# EAGLE design working (EAGLE 6.4)
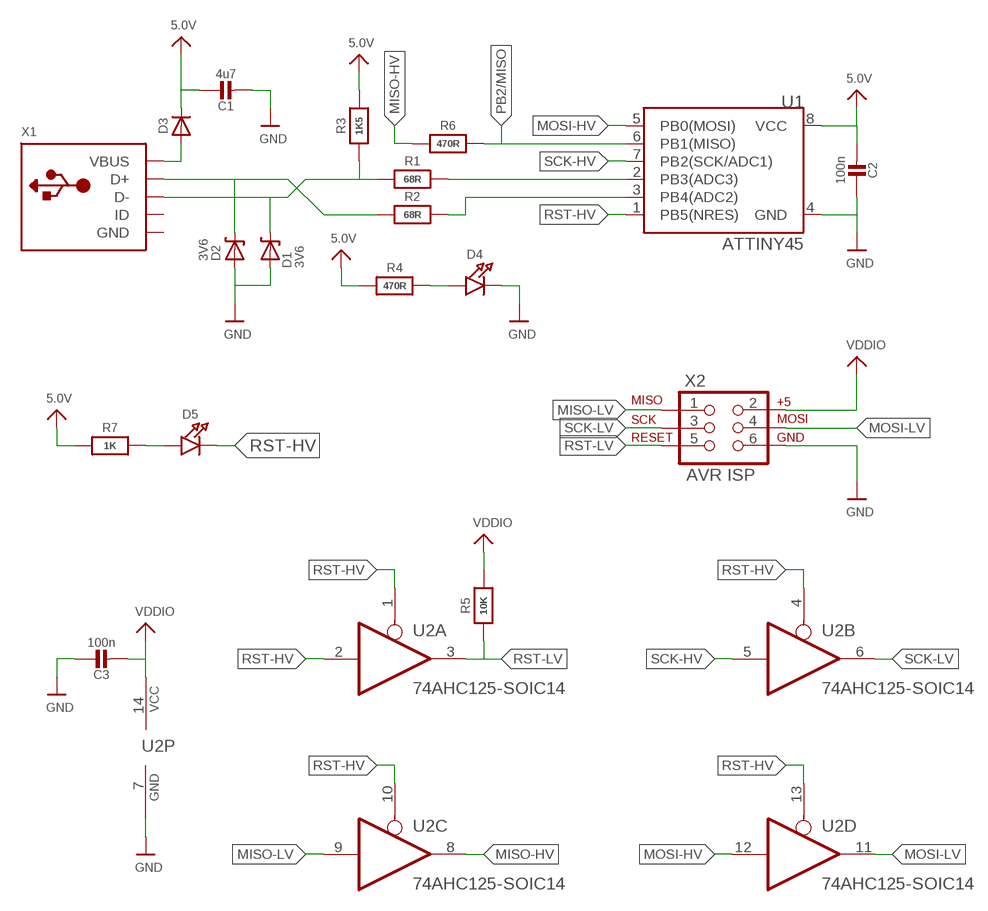
[diagram p0: schematic, sheet 1]

## Parts
C1  4u7  CAP_CERAMIC0805-NOOUTLINE  [0805-NO]
C2  100n  CAP_CERAMIC0805-NOOUTLINE  [0805-NO]
C3  100n  CAP_CERAMIC0805-NOOUTLINE  [0805-NO]
D1  3V6  DIODE-ZENERSOD323  [SOD-323]
D2  3V6  DIODE-ZENERSOD323  [SOD-323]
D3  DIODESOD-123  [SOD-123]
D4  LED0805_NOOUTLINE  [CHIPLED_0805_NOOUTLINE]
D5  LED0805_NOOUTLINE  [CHIPLED_0805_NOOUTLINE]
R1  68R  RESISTOR_0603_NOOUT  [0603-NO]
R2  68R  RESISTOR_0603_NOOUT  [0603-NO]
R3  1K5  RESISTOR_0603_NOOUT  [0603-NO]
R4  470R  RESISTOR_0603_NOOUT  [0603-NO]
R5  10K  RESISTOR_0603_NOOUT  [0603-NO]
R6  470R  RESISTOR_0603_NOOUT  [0603-NO]
R7  1K  RESISTOR_0603_NOOUT  [0603-NO]
U1  ATTINY45  [SO08-EIAJ]
U2  74AHC125-SOIC14  74125-SOIC14  [SOIC14]
X1  USBMINIBLARGE  [USB-MINIB_LARGER]
X2  AVR ISP  AVR_SPI_PRG_6SMD  [2X3_SMD]

## Nets
5.0V: C1.1 C2.2 D3.C R3.2 R4.1 R7.1 U1.8(VCC)
GND: C1.2 C2.1 C3.1 D1.A D2.A D4.C U1.4(GND) U2.7(P:GND) X2.6
MISO-HV: R6.1 U2.8(C:O)
MISO-LV: U2.9(C:I) X2.1
MOSI-HV: U1.5(PB0(MOSI)) U2.12(D:I)
MOSI-LV: U2.11(D:O) X2.4
N$1: D1.C R1.1 R3.1 X1.D-
N$2: D2.C R2.1 X1.D+
N$3: D5.A R7.2
N$4: R1.2 U1.2(PB3(ADC3))
N$5: R2.2 U1.3(PB4(ADC2))
N$7: D3.A X1.VBUS
N$9: D4.A R4.2
PB2/MISO: R6.2 U1.6(PB1(MISO))
RST-HV: D5.C U1.1(PB5(NRES)) U2.1(A:OE) U2.2(A:I) U2.4(B:OE) U2.10(C:OE) U2.13(D:OE)
RST-LV: R5.1 U2.3(A:O) X2.5
SCK-HV: U1.7(PB2(SCK/ADC1)) U2.5(B:I)
SCK-LV: U2.6(B:O) X2.3
VDDIO: C3.2 R5.2 U2.14(P:VCC) X2.2
Unconnected: X1.ID

## Power pins joined to a net without a drawn wire
GND: X1.GND X1.GND1(GND) X1.GND2(GND) X1.GND3(GND) X1.GND4(GND)

## Library data of the parts
C1-C3 = microbuilder:CAP_CERAMIC: Ceramic Capacitors For new designs, use the packages preceded by an '_' character since they are more reliable: The following footprints should be used on most boards: _0402 - Standard footprint for regular board layouts _0603 - Standard footprint for regular board layouts _0805 - Standard footprint for regular board layouts _1206 - Standard footprint for regular board layouts For extremely tight-pitch boards where space is at a premium, the following 'micro-pitch' footprints can be used (smaller pads, no silkscreen outline, etc.): _0402MP - Micro-pitch footprint for very dense/compact boards _0603MP - Micro-pitch footprint for very dense/compact boards _0805MP - Micro-pitch footprint for very dense/compact boards _1206MP - Micro-pitch footprint for very dense/compact boards
D1 D2 = microbuilder:DIODE-ZENER: Zener Diode SMA: 30V 1W Zener Diode, 1.2Vf - Digikey: SMAZ30-FDICT-ND
D3 = microbuilder:DIODE: Diode SMA Model Volts Amps Type Vf Ir Digikey # Notes SSA34-E3 40V 3A Schottky 480mV @ 3A 200uA @ 40V SSA34-E3/61TGITR-ND CDBA120-G 20V 1A Schottky 500mV @ 1A 500uA @ 20V 641-1014-6-ND REEL MBRA210 10V 2A Schottky 350mV @ 2A 700uA @ 10V MBRA210LT3 SOD-123 Model Volts Amps Type Vf Ir Order # Notes BAT54T1G 30V 200mA Schottky 800mV @ 200mA 2uA @ 25V BAT54T1GOSTR-ND B0530W 30V 500mA Schottky 430mV @ 500mA 130uA @ 30V B0530W-FDICT-ND REEL MBR120 20V 1A Schottky 340mV @ 1A MBR120VLSFT1GOSCT-ND SOD-323 Model Volts Amps Type Vf Ir Order # Notes PMEG2005EJ 20V 500mA Schottky 355mV @ 500mA 568-4110-1-ND ZLLS410 10V 570mA Schottky 380mV @ 570mA ZLLS410CT-ND 1N4148WS 75V 150mA Silicon/Simple 1V 1N4148WSFSCT-ND REEL SOD-523 Model Volts Amps Type Vf Ir Order # Notes BAT54XV2 30V 200mA Schottky 0.8V @ 100mA BAT54XV2CT-ND TB751S 30V 30mA Schottky RB751S-40TE61CT-ND SOT23-R/W (R = Solder Paste/Reflow Ovens, W = Hand-Soldering) Model Volts Amps Type Vf Ir Order # Notes BAT54FILM 40V 300mA Schottky 497-7162-1-ND POWERDI-5 Model Volts Amps Type Vf Ir Order # Notes PDS560 60V 5A Schottky 670mV @ 5A 150uA @ 60V PDS560DICT-ND
D4 D5 = microbuilder:LED: LED 0603 - 0603 Surface Mount Package 2mA: Green LED - Low Power (3.9mcd, 2ma, 1.7Vf) - Digikey: 475-2709-2-ND Orange LED - Low Power (9.8mcd, 2ma, 1.8Vf) - Digikey: 475-1194-2-ND Red LED - Low Power (5mcd, 2ma, 1.8Vf) - Digikey: 475-1195-2-ND Yellow LED - Low Power (7mcd, 2ma, 1.8Vf) - Digikey: 475-1196-2-ND 5mA: Blue LED - Low Power (17mcd, 5ma, 2.9Vf) - Digikey: LNJ937W8CRACT-ND 0805 - 0805 Surface Mount Package 2mA: Red LED (8.8mcd, 2mA, 1.8Vf, Clear) - Low Power [Digikey: 475-2510-1-ND] Green LED (5mcd, 2mA, 1.8Vf, Clear) - Low Power [Digikey: 475-2730-1-ND] Yellow LED (11.3mcd, 2mA, 1.8Vf, Clear) - Low Power [Digikey: 475-2555-1-ND] 20mA: Red LED (104mcd, 20mA, Diffused) - LS R976 [Digikey: 475-1278-6-ND] Red LED (12mcd, 20mA, 2.0Vf, Clear) - APT2012EC [Digikey: 754-1128-1-ND] Green LED (15mcd, 20mA, 2.2Vf, Clear) - APT2012GC [Digikey: 754-1131-1-ND] Orange LED (160mcd, 20mA, 2.1Vf, Clear) - APT2012SECK [Digikey: 754-1130-1-ND] 1206 - 1206 Surface Mount Package Green LED (26mcd, 20mA, Diffused) - LG N971 [Digikey: 475-1407-6-ND] Red LED (15mcd, 20mA, Diffused) - LH N974 [Digikey: 475-1416-6-ND] Cree - Cree High-Power Surface Mount LEDs XPEBWT-L1-0000-00D50 - White 111lm 350mA 2.9Vf 6200K 110° XTEAWT-00-0000-00000LEE3 - White 114lm 350mA 2.85Vf 5000K 115° Everlight - Everlight 45-21 Series Surface Mount LEDs 45-21/QK2C-B2832AC2CB2/2T - Warm White 2000mcd 20mA 3.25Vf 3050K 120° 45-21/LK2C-B38452C4CB2/2T - Nuetral White 2000mcd 20mA 3.25Vf 4150K 120° 45-21/LK2C-B50634C6CB2/2T - Cold White 2200mcd 20mA 3.25Vf 5650K 120° PLCC2 Reverse Mount LS T77K-J1L2-1-0-2-R18-Z - Red 11.25mcd 2mA 1.8Vf 630nm 120° LO T77K-L1M2-24-Z - Orange 19.6mcd 2mA 1.8Vf 606nm 120° LY T77K-K2M1-26-Z - Yellow 15.7mcd 2mA 1.8Vf 587nm 120°
R1-R7 = microbuilder:RESISTOR: Resistors For new designs, use the packages preceded by an '_' character since they are more reliable: The following footprints should be used on most boards: _0402 - Standard footprint for regular board layouts _0603 - Standard footprint for regular board layouts _0805 - Standard footprint for regular board layouts _1206 - Standard footprint for regular board layouts For extremely tight-pitch boards where space is at a premium, the following 'micro-pitch' footprints can be used (smaller pads, no silkscreen outline, etc.): _0402MP - Micro-pitch footprint for very dense/compact boards _0603MP - Micro-pitch footprint for very dense/compact boards _0805MP - Micro-pitch footprint for very dense/compact boards _1206MP - Micro-pitch footprint for very dense/compact boards
U1 = LittleWireISP:ATTINY45: Atmel ATTiny45
U2 = LittleWireISP:74*125: Quad bus BUFFER, 3-state
X1 = microbuilder:USB: USB Connectors USBMINIB - Surface Mount Female Mini-B USB Connector 4UConnector: 06564
X2 = LittleWireISP:AVR_SPI_PRG_6: AVR ISP 6 Pin This is the reduced ISP connector for AVR programming. Common on Arduino. This footprint will take up less PCB space and can be used with a 10-pin to 6-pin adapter such as SKU: BOB-08508

## Board
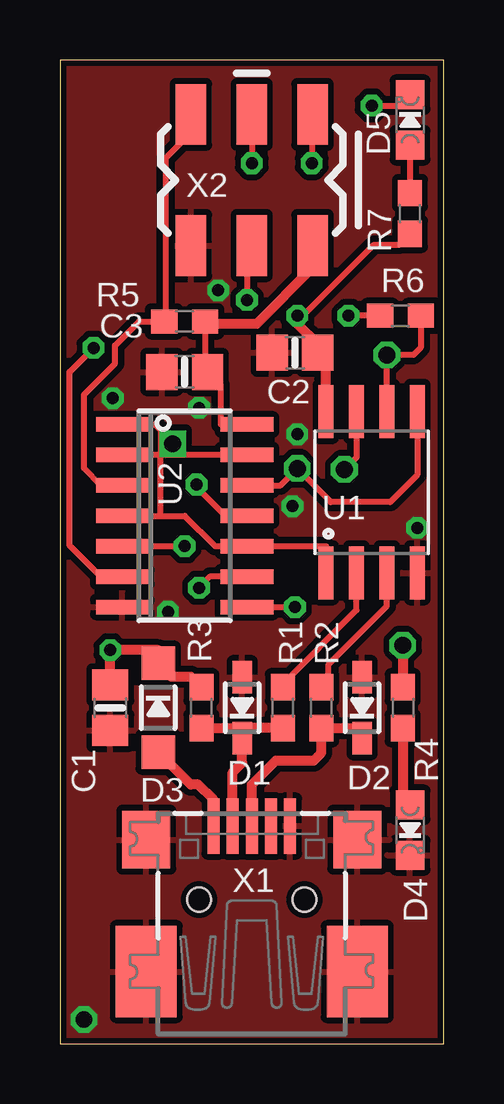
[diagram p1: board, top side]
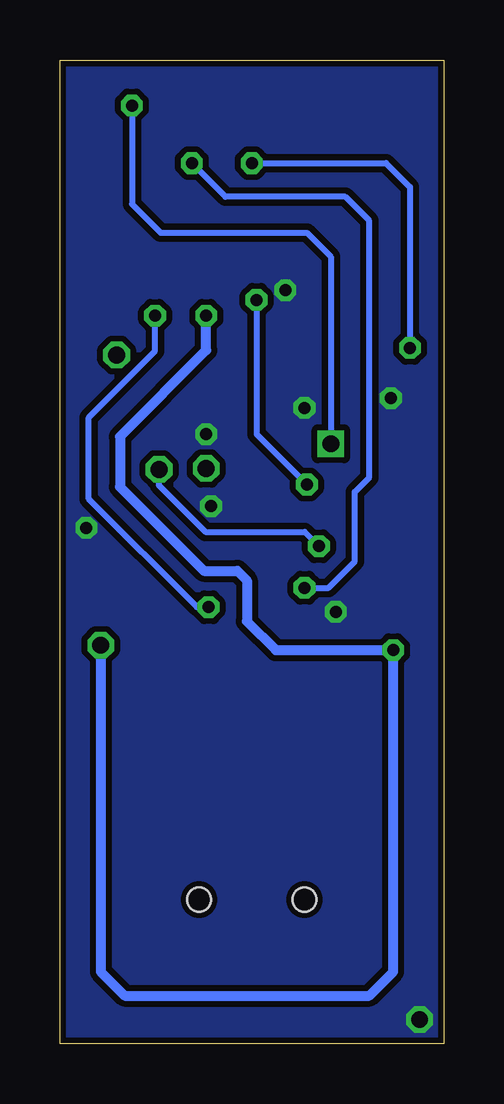
[diagram p2: board, bottom side, seen from below]

Size 16 x 41 mm. Coordinates in mm from the lower left corner, seen from the top.
Outline: 0,0 16,0 16,41 0,41 0,0
Copper layers (1*16): Top 0.035mm / dielectric 1.5mm / Bottom 0.035mm
Design rules "adafruit_rules_2": minimum track width 8mil, minimum drill 15.5mil, track to track 8mil, track to pad 8mil, pad to pad 8mil, via to via 8mil, smd to smd 8mil, copper to edge 10mil, drill to drill 8mil, minimum pad ring 10mil, minimum via ring 8mil, stop-mask expansion 4mil, vias tented up to drill 25mil, thermal gap 10mil

### Footprints (pad centres in the part's own frame; a part is rotated, then mirrored left to right if it is on the bottom)
0805-NO = smd 1.3 x 1.5: 1 -0.95,0; 2 0.95,0
SOD-323 = smd 1.35 x 0.8: A 1.27,0; C -1.27,0
SOD-123 = smd 1.4 x 1.4: A 1.85,0; C -1.85,0
CHIPLED_0805_NOOUTLINE = smd 1.2 x 1.2: A 0,-1.05; C 0,1.05
0603-NO = smd 1.1 x 1: 1 -0.85,0; 2 0.85,0
SO08-EIAJ = smd 0.61 x 2.21: 1 -1.905,-3.378; 2 -0.635,-3.378; 3 0.635,-3.378; 4 1.905,-3.378; 5 1.905,3.353; 6 0.635,3.353; 7 -0.635,3.353; 8 -1.905,3.353
SOIC14 = smd 0.6 x 2.2: 1 -3.81,-2.6; 2 -2.54,-2.6; 3 -1.27,-2.6; 4 0,-2.6; 5 1.27,-2.6; 6 2.54,-2.6; 7 3.81,-2.6; 8 3.81,2.6; 9 2.54,2.6; 10 1.27,2.6; 11 0,2.6; 12 -1.27,2.6; 13 -2.54,2.6; 14 -3.81,2.6
USB-MINIB_LARGER = smd 0.5 x 2.308: D+ 0,4.064; D- -0.8,4.064; GND 1.6,4.064; ID 0.8,4.064; VBUS -1.6,4.064 | smd 2.54 x 3.81: GND1 -4.4,-2; GND4 4.4,-2 | smd 2 x 2.4: GND2 -4.4,3.5; GND3 4.4,3.5 | hole 1: -2.2,1; 2.2,1
2X3_SMD = smd 2.54 x 1.27: 1 -2.73,2.54; 2 2.73,2.54; 3 -2.73,0; 4 2.73,0; 5 -2.73,-2.54; 6 2.73,-2.54

### Placement (x,y rotation side)
C1  2.1,14 270 top
C2  9.8,28.8 0 top
C3  5.2,28 0 top
D1  7.6,14 90 top
D2  12.6,14 90 top
D3  4.1,14 270 top
D4  14.6,8.9 180 top
D5  14.6,38.5 0 top
R1  9.3,14 90 top
R2  10.9,14 90 top
R3  5.9,14 90 top
R4  14.3,14 270 top
R5  5.2,30.1 0 top
R6  14.2,30.34 0 top
R7  14.6,34.6 90 top
U1  13,23 0 top
U2  5.2,22 270 top
X1  8,5 0 top
X2  8,36 270 top

### Tracks (layer width: path | path; a pad name or v marks a point on that pad's centre or on a via)
5.0V  (via drill 0.5, 0.7)
  Top 0.254: v9.9,30.34 10.13,30.34 13.1,33.3 14.15,33.3 R7.1
  Top 0.406: C1.1 v2.1,16.4 4.1,16.4 D3.C 4.65,15.3 5.45,15.3 R3.2 | v14.3,16.6 R4.1 | U1.8 11.1,28.8 C2.2 10.75,29.15 9.9,30 v9.9,30.34
  Bottom 0.406: v14.3,16.6 14.3,3 13.3,2 3.1,2 2.1,3 v2.1,16.4 7,16.4 8.2,17.6 8.2,19.3 8.6,19.7 10,19.7 13.5,23.2 13.5,25.3 9.9,28.9 v9.9,30.34
GND  (via drill 0.5, 0.7)
  other vias: 5.8,26.5 4.5,18 14.9,21.5 1,1 9.9,25.4 9.7,22.4 6.6,31.4 2.2,26.9
  pour Bottom (isolate 0.254): 0,0 16,0 16,41 0,41
  pour Top (isolate 0.254): 0,0 16,0 16,41 0,41
MISO-HV  (via drill 0.5)
  Top 0.254: U2.8 v9.8,18.19 | R6.1 v12.04,30.34
  Bottom 0.254: v9.8,18.19 10.29,18.19 14.8,22.7 14.8,26.1 12.04,28.86 v12.04,30.34
MISO-LV  (via drill 0.5)
  Top 0.254: U2.9 6.26,19.46 v5.8,19 | X2.1 10.5,38.69 v10.5,36.7
  Bottom 0.254: v5.8,19 4.8,19 3.7,20.1 3.7,23 3.1,23.6 3.1,34.3 4.1,35.3 9.1,35.3 v10.5,36.7
MOSI-HV  (via drill 0.7)
  Top 0.254: U1.5 14.9,23.7 13.78,22.57 11.3,22.57 v9.9,23.97 9.2,23.27 U2.12
MOSI-LV  (via drill 0.5)
  Top 0.254: U2.11 6.9,22 5.7,23.2 v5.7,23.3 | X2.4 7.8,33.27 v7.8,31
  Bottom 0.254: v7.8,31 7.8,25.4 v5.7,23.3
N$1
  Top 0.406: X1.D- 7.2,11.3 7.6,11.7 D1.C 7.6,13.15 | R3.1 7.6,13.15 | R1.1 7.6,13.15
N$2
  Top 0.406: X1.D+ 8,10.8 9,11.8 10.58,11.8 10.9,12.12 R2.1 12.6,13.15 D2.C
N$3
  Top 0.254: D5.A R7.2
N$4
  Top 0.254: R1.2 9.3,15 12.37,18.07 U1.2
N$5
  Top 0.254: R2.2 11.2,15.15 11.2,15.8 13.63,18.23 U1.3
N$7
  Top 0.406: X1.VBUS 6.4,10.17 5.77,10.8 5.45,10.8 D3.A
N$9
  Top 0.406: R4.2 14.3,9.95 D4.A
PB2/MISO  (via drill 0.7)
  Top 0.254: U1.6 v13.63,28.7 14.75,28.7 15.05,29 R6.2
RST-HV  (via drill 0.5, 0.7)
  Top 0.254: U2.13 4.7,24.54 | 4.7,24.54 4.2,24.54 | 4.2,24.54 U2.2 | U1.1 11.1,20.73 U2.10 6.47,20.73 5.2,22 4.2,22 | U2.1 3.97,25.81 4.2,25.58 4.2,24.54 | 4.2,22 4.2,24.54 | U2.4 4.2,22 | v4.7,25 4.7,24.54 | v13,39.1 14.6,39.1 D5.C
  Bottom 0.254: v13,39.1 13,35 11.8,33.8 5.7,33.8 4.7,32.8 v4.7,25
RST-LV
  Top 0.254: U2.3 1.7,23.27 1,23.97 1,27.05 2.3,28.35 2.3,29.1 3.3,30.1 R5.1 4.4,30.15 4.4,36.9 5.46,37.96 X2.5
SCK-HV  (via drill 0.5, 0.7)
  Top 0.254: U2.5 v5.2,20.73 | U1.7 12.37,24.43 v11.87,23.93
  Bottom 0.254: v5.2,20.73 5.8,21.33 9.93,21.33 11.87,23.27 v11.87,23.93
SCK-LV  (via drill 0.5)
  Top 0.254: U2.6 1.7,19.46 0.4,20.76 0.4,28 v1.4,29 | X2.3 v8,36.7
  Bottom 0.254: v8,36.7 2.4,36.7 1.4,35.7 v1.4,29
VDDIO
  Top 0.254: U2.14 6.7,25.81 6.7,27.45 C3.2 6.05,28.1 R5.2
  Top 0.406: X2.2 10.54,32.34 8.2,30 6.05,30 R5.2